# EAGLE design sample64pin (EAGLE 7.1.0)
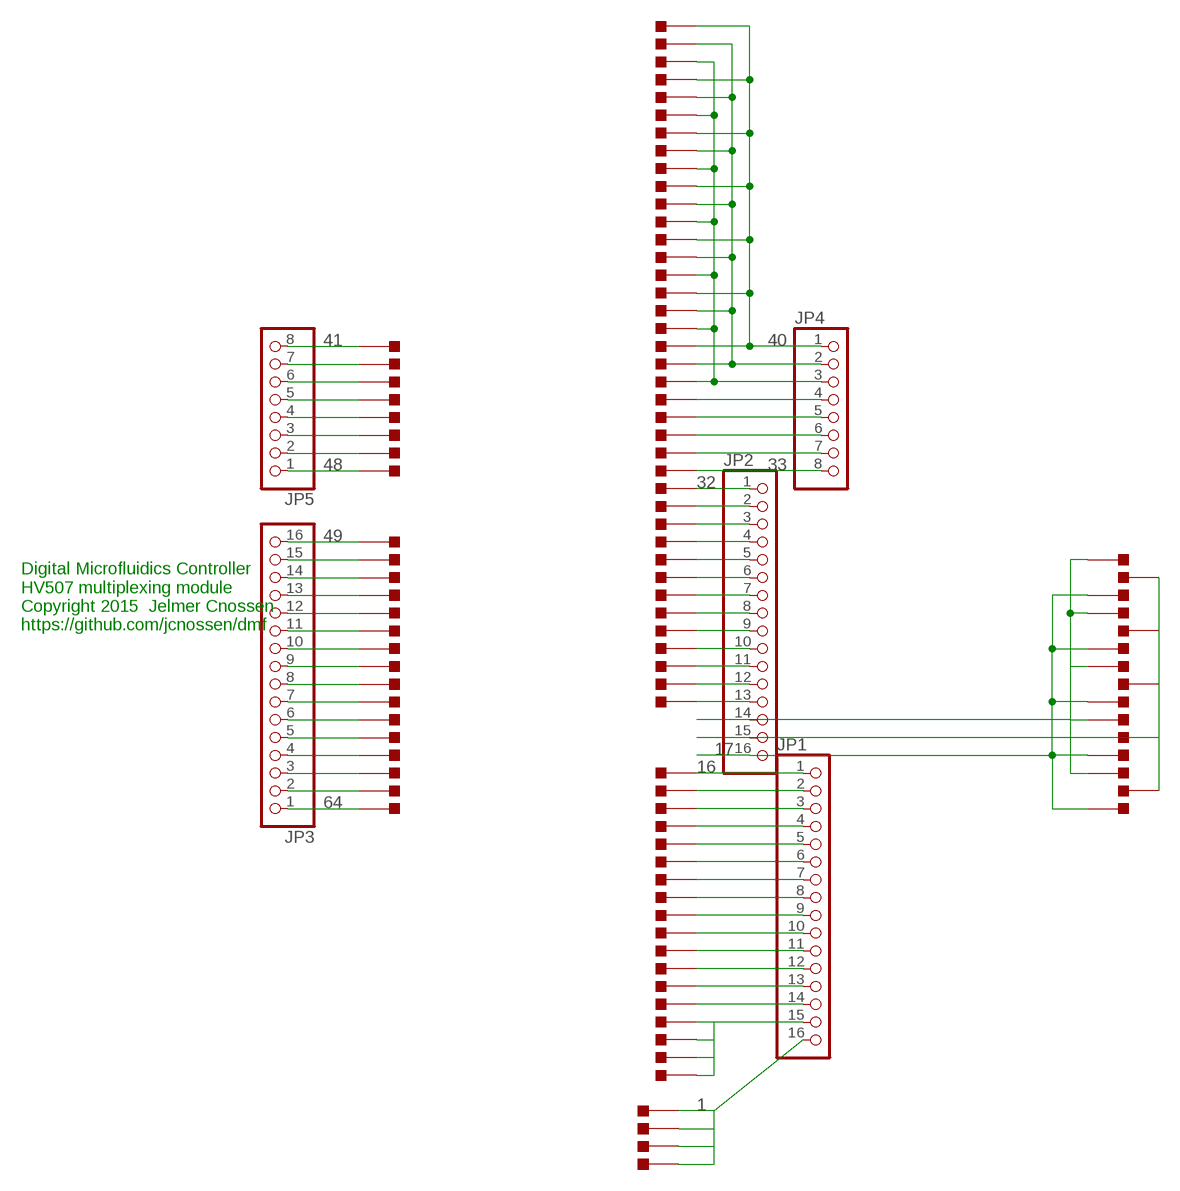
[diagram p0: schematic, sheet 1]

## Parts
JP1  PINHD-1X16_2.54-S  [1X16-S]
JP2  PINHD-1X16_2.54-S  [1X16-S]
JP3  PINHD-1X16_2.54-S  [1X16-S]
JP4  PINHD-1X08_2.54-S  [1X08-S]
JP5  PINHD-1X08_2.54-S  [1X08-S]
U$1  ELECTRODE  [ELECTRODE]
U$2  ELECTRODE  [ELECTRODE]
U$3  ELECTRODE  [ELECTRODE]
U$4  ELECTRODE  [ELECTRODE]
U$5  ELECTRODE  [ELECTRODE]
U$6  ELECTRODE  [ELECTRODE]
U$7  ELECTRODE  [ELECTRODE]
U$8  ELECTRODE  [ELECTRODE]
U$9  ELECTRODE  [ELECTRODE]
U$10  ELECTRODE  [ELECTRODE]
U$11  ELECTRODE  [ELECTRODE]
U$12  ELECTRODE  [ELECTRODE]
U$13  ELECTRODE  [ELECTRODE]
U$14  ELECTRODE  [ELECTRODE]
U$15  ELECTRODE  [ELECTRODE]
U$16  ELECTRODE  [ELECTRODE]
U$17  ELECTRODE  [ELECTRODE]
U$18  ELECTRODE  [ELECTRODE]
U$19  ELECTRODE  [ELECTRODE]
U$20  ELECTRODE  [ELECTRODE]
U$21  ELECTRODE  [ELECTRODE]
U$22  ELECTRODE  [ELECTRODE]
U$23  ELECTRODE  [ELECTRODE]
U$24  ELECTRODE  [ELECTRODE]
U$25  ELECTRODE  [ELECTRODE]
U$26  ELECTRODE  [ELECTRODE]
U$27  ELECTRODE  [ELECTRODE]
U$28  ELECTRODE  [ELECTRODE]
U$29  ELECTRODE  [ELECTRODE]
U$30  ELECTRODE  [ELECTRODE]
U$31  ELECTRODE  [ELECTRODE]
U$32  ELECTRODE  [ELECTRODE]
U$33  ELECTRODE  [ELECTRODE]
U$34  ELECTRODE  [ELECTRODE]
U$35  ELECTRODE  [ELECTRODE]
U$36  ELECTRODE  [ELECTRODE]
U$37  ELECTRODE  [ELECTRODE]
U$38  ELECTRODE  [ELECTRODE]
U$39  ELECTRODE  [ELECTRODE]
U$40  ELECTRODE  [ELECTRODE]
U$41  ELECTRODE  [ELECTRODE]
U$42  ELECTRODE  [ELECTRODE]
U$43  ELECTRODE  [ELECTRODE]
U$44  ELECTRODE  [ELECTRODE]
U$45  ELECTRODE  [ELECTRODE]
U$46  ELECTRODE  [ELECTRODE]
U$47  ELECTRODE  [ELECTRODE]
U$48  ELECTRODE  [ELECTRODE]
U$49  ELECTRODE  [ELECTRODE]
U$50  ELECTRODE  [ELECTRODE]
U$51  ELECTRODE  [ELECTRODE]
U$52  ELECTRODE  [ELECTRODE]
U$53  ELECTRODE  [ELECTRODE]
U$54  ELECTRODE  [ELECTRODE]
U$55  ELECTRODE  [ELECTRODE]
U$56  ELECTRODE  [ELECTRODE]
U$57  ELECTRODE  [ELECTRODE]
U$58  ELECTRODE  [ELECTRODE]
U$59  ELECTRODE  [ELECTRODE]
U$60  ELECTRODE  [ELECTRODE]
U$61  ELECTRODE  [ELECTRODE]
U$62  ELECTRODE  [ELECTRODE]
U$63  ELECTRODE  [ELECTRODE]
U$64  ELECTRODE  [ELECTRODE]
U$65  ELECTRODE  [ELECTRODE]
U$66  ELECTRODE  [ELECTRODE]
U$67  ELECTRODE  [ELECTRODE]
U$68  ELECTRODE  [ELECTRODE]
U$69  ELECTRODE  [ELECTRODE]
U$70  ELECTRODE  [ELECTRODE]
U$71  ELECTRODE  [ELECTRODE]
U$72  ELECTRODE  [ELECTRODE]
U$73  ELECTRODE  [ELECTRODE]
U$74  ELECTRODE  [ELECTRODE]
U$75  ELECTRODE  [ELECTRODE]
U$76  ELECTRODE  [ELECTRODE]
U$77  ELECTRODE  [ELECTRODE]
U$78  ELECTRODE  [ELECTRODE]
U$79  ELECTRODE  [ELECTRODE]
U$80  ELECTRODE  [ELECTRODE]
U$81  ELECTRODE  [ELECTRODE]
U$82  ELECTRODE  [ELECTRODE]
U$83  ELECTRODE  [ELECTRODE]
U$84  ELECTRODE  [ELECTRODE]
U$85  ELECTRODE  [ELECTRODE]
U$86  ELECTRODE  [ELECTRODE]
U$87  ELECTRODE  [ELECTRODE]
U$88  ELECTRODE  [ELECTRODE]
U$89  ELECTRODE  [ELECTRODE]
U$90  ELECTRODE  [ELECTRODE]
U$91  ELECTRODE  [ELECTRODE]
U$92  ELECTRODE  [ELECTRODE]
U$93  ELECTRODE  [ELECTRODE]
U$94  ELECTRODE  [ELECTRODE]
U$95  ELECTRODE  [ELECTRODE]
U$96  ELECTRODE  [ELECTRODE]
U$97  ELECTRODE  [ELECTRODE]
U$98  ELECTRODE  [ELECTRODE]
U$99  ELECTRODE  [ELECTRODE]
U$100  ELECTRODE  [ELECTRODE]

## Nets
1: JP1.16 U$46.P$2(E) U$47.P$2(E) U$48.P$2(E) U$64.P$2(E)
16: JP1.1 U$49.P$2(E)
17: JP2.16 U$67.P$2(E) U$70.P$2(E) U$73.P$2(E) U$76.P$2(E) U$79.P$2(E)
32: JP2.1 U$33.P$2(E)
33: JP4.8 U$32.P$2(E)
40: JP4.1 U$1.P$2(E) U$80.P$2(E) U$83.P$2(E) U$86.P$2(E) U$89.P$2(E) U$92.P$2(E) U$95.P$2(E)
41: JP5.8 U$4.P$2(E)
48: JP5.1 U$11.P$2(E)
49: JP3.16 U$12.P$2(E)
64: JP3.1 U$27.P$2(E)
N$1: JP2.14 U$65.P$2(E) U$68.P$2(E) U$71.P$2(E) U$74.P$2(E) U$77.P$2(E)
N$2: JP1.2 U$50.P$2(E)
N$3: JP1.3 U$51.P$2(E)
N$4: JP1.4 U$52.P$2(E)
N$5: JP1.5 U$53.P$2(E)
N$6: JP1.6 U$54.P$2(E)
N$7: JP1.7 U$55.P$2(E)
N$8: JP1.8 U$56.P$2(E)
N$9: JP1.9 U$57.P$2(E)
N$10: JP1.10 U$58.P$2(E)
N$11: JP1.11 U$59.P$2(E)
N$12: JP1.12 U$60.P$2(E)
N$13: JP1.13 U$61.P$2(E)
N$14: JP1.14 U$62.P$2(E)
N$15: JP1.15 U$63.P$2(E) U$98.P$2(E) U$99.P$2(E) U$100.P$2(E)
N$17: JP2.15 U$66.P$2(E) U$69.P$2(E) U$72.P$2(E) U$75.P$2(E) U$78.P$2(E)
N$18: JP2.2 U$34.P$2(E)
N$19: JP2.3 U$35.P$2(E)
N$20: JP2.4 U$36.P$2(E)
N$21: JP2.5 U$37.P$2(E)
N$22: JP2.6 U$38.P$2(E)
N$23: JP2.7 U$39.P$2(E)
N$24: JP2.8 U$40.P$2(E)
N$25: JP2.9 U$41.P$2(E)
N$26: JP2.10 U$42.P$2(E)
N$27: JP2.11 U$43.P$2(E)
N$28: JP2.12 U$44.P$2(E)
N$29: JP2.13 U$45.P$2(E)
N$34: JP3.2 U$26.P$2(E)
N$35: JP3.3 U$25.P$2(E)
N$36: JP3.4 U$24.P$2(E)
N$37: JP3.5 U$23.P$2(E)
N$38: JP3.6 U$22.P$2(E)
N$39: JP3.7 U$21.P$2(E)
N$40: JP3.8 U$20.P$2(E)
N$41: JP3.9 U$19.P$2(E)
N$42: JP3.10 U$18.P$2(E)
N$43: JP3.11 U$17.P$2(E)
N$44: JP3.12 U$16.P$2(E)
N$45: JP3.13 U$15.P$2(E)
N$46: JP3.14 U$14.P$2(E)
N$47: JP3.15 U$13.P$2(E)
N$50: JP4.2 U$2.P$2(E) U$81.P$2(E) U$84.P$2(E) U$87.P$2(E) U$90.P$2(E) U$93.P$2(E) U$96.P$2(E)
N$51: JP4.3 U$3.P$2(E) U$82.P$2(E) U$85.P$2(E) U$88.P$2(E) U$91.P$2(E) U$94.P$2(E) U$97.P$2(E)
N$52: JP4.4 U$28.P$2(E)
N$53: JP4.5 U$29.P$2(E)
N$54: JP4.6 U$30.P$2(E)
N$55: JP4.7 U$31.P$2(E)
N$58: JP5.2 U$10.P$2(E)
N$59: JP5.3 U$9.P$2(E)
N$60: JP5.4 U$8.P$2(E)
N$61: JP5.5 U$7.P$2(E)
N$62: JP5.6 U$6.P$2(E)
N$63: JP5.7 U$5.P$2(E)

## Notes on the sheet
- Digital Microfluidics Controller
  HV507 multiplexing module
  Copyright 2015  Jelmer Cnossen  
  https://github.com/jcnossen/dmf

## Library data of the parts
JP1-JP3 = pinhead-2:PINHD-1X16: PIN HEADER
JP4 JP5 = pinhead-2:PINHD-1X08: PIN HEADER
U$1-U$100 = hvgen:ELECTRODE

## Board
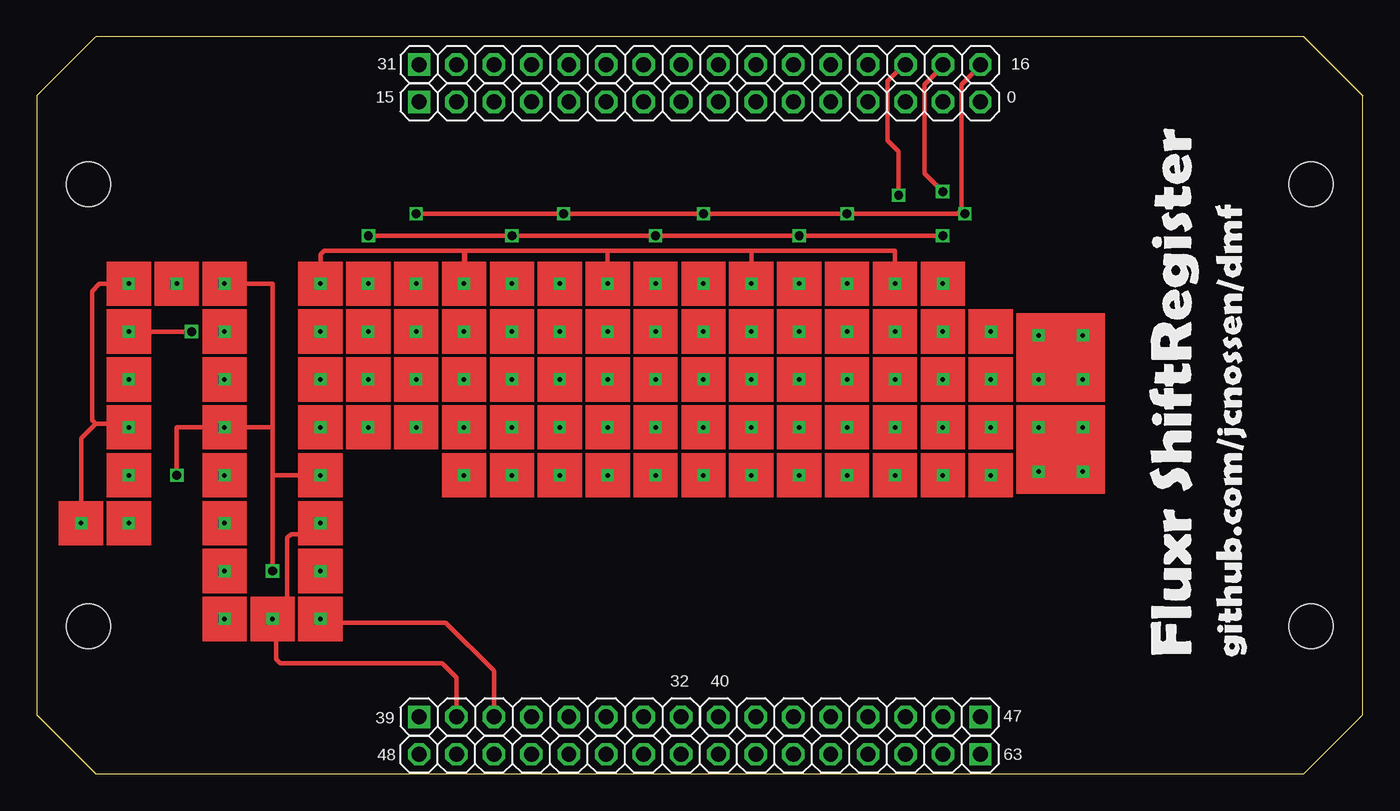
[diagram p1: board, top side]
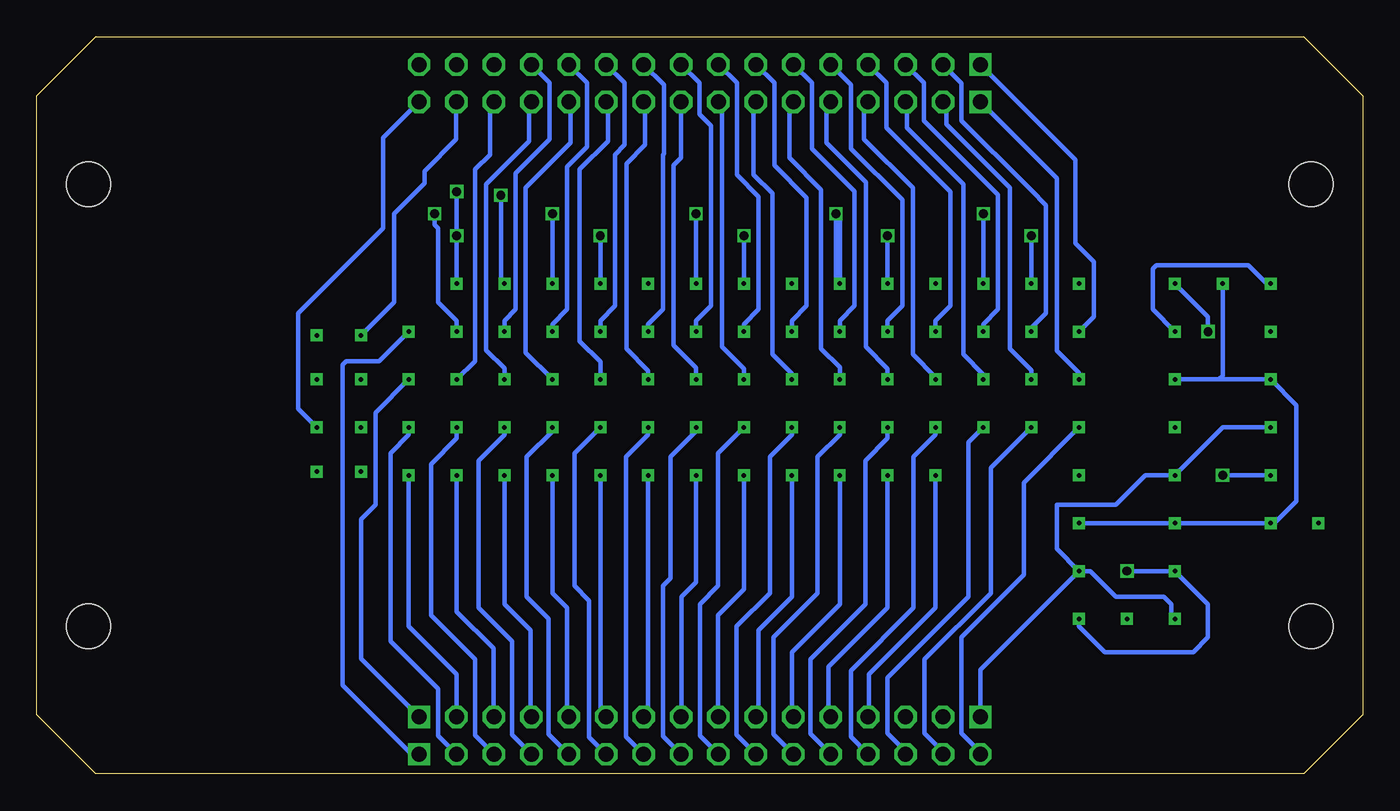
[diagram p2: board, bottom side, seen from below]

Size 90 x 50 mm. Coordinates in mm from the lower left corner, seen from the top.
Outline: 4,0 86,0 90,4 90,46 86,50 4,50 0,46 0,4 4,0
Copper layers (1*16): Top 0.035mm / dielectric 1.5mm / Bottom 0.035mm
Design rules "dirt_cheap_dirty_boards.v1": minimum track width 5mil, minimum drill 12mil, track to track 5mil, track to pad 5mil, pad to pad 5mil, via to via 5mil, smd to smd 0mil, copper to edge 10mil, drill to drill 10mil, minimum pad ring 10mil, minimum via ring 6mil, stop-mask expansion 2mil, vias tented up to drill 25mil, thermal gap 10mil
Holes 3 mm at 86.5,40 86.5,10 3.5,10 3.5,40

### Footprints (pad centres in the part's own frame; a part is rotated, then mirrored left to right if it is on the bottom)
1X16-S = drill 1.016 square: 1 -19.05,0 | drill 1.016 octagon: 2 -16.51,0; 3 -13.97,0; 4 -11.43,0; 5 -8.89,0; 6 -6.35,0; 7 -3.81,0; 8 -1.27,0; 9 1.27,0; 10 3.81,0; 11 6.35,0; 12 8.89,0; 13 11.43,0; 14 13.97,0; 15 16.51,0; 16 19.05,0
1X08-S = drill 1.016 square: 1 -8.89,0 | drill 1.016 octagon: 2 -6.35,0; 3 -3.81,0; 4 -1.27,0; 5 1.27,0; 6 3.81,0; 7 6.35,0; 8 8.89,0
ELECTRODE = drill 0.305 square: P$2 0,0

### Placement (x,y rotation side)
JP1  45,45.58 0 top
JP2  45,48.12 0 top
JP3  45,1.32 180 top
JP4  34.84,3.86 0 top
JP5  55.16,3.86 180 top
U$1  19.25,13.75 90 top
U$2  19.25,17 90 top
U$3  19.25,20.25 90 top
U$4  45.25,20.25 0 top
U$5  48.5,20.25 0 top
U$6  51.75,20.25 0 top
U$7  55,20.25 0 top
U$8  58.25,20.25 0 top
U$9  61.5,20.25 0 top
U$10  64.75,20.25 0 top
U$11  64.75,26.75 0 top
U$12  19.25,23.5 90 top
U$13  22.5,23.5 90 top
U$14  25.75,23.5 90 top
U$15  29,23.5 90 top
U$16  32.25,23.5 90 top
U$17  35.5,23.5 90 top
U$18  38.75,23.5 90 top
U$19  42,23.5 90 top
U$20  45.25,23.5 90 top
U$21  48.5,23.5 90 top
U$22  51.75,23.5 90 top
U$23  55,23.5 90 top
U$24  58.25,23.5 90 top
U$25  61.5,23.5 90 top
U$26  64.75,23.5 90 top
U$27  64.75,30 90 top
U$28  29,20.25 90 top
U$29  32.25,20.25 90 top
U$30  35.5,20.25 90 top
U$31  38.75,20.25 90 top
U$32  42,20.25 90 top
U$33  19.25,30 90 top
U$34  22.5,30 90 top
U$35  25.75,30 90 top
U$36  29,30 90 top
U$37  32.25,30 90 top
U$38  35.5,30 90 top
U$39  38.75,30 90 top
U$40  42,30 90 top
U$41  45.25,30 90 top
U$42  48.5,30 90 top
U$43  51.75,30 90 top
U$44  55,30 90 top
U$45  58.25,30 90 top
U$46  68,20.5 0 top
U$47  71,20.5 0 top
U$48  71,23.5 0 top
U$49  19.25,26.75 90 top
U$50  22.5,26.75 90 top
U$51  25.75,26.75 90 top
U$52  29,26.75 90 top
U$53  32.25,26.75 90 top
U$54  35.5,26.75 90 top
U$55  38.75,26.75 90 top
U$56  42,26.75 90 top
U$57  45.25,26.75 90 top
U$58  48.5,26.75 90 top
U$59  51.75,26.75 90 top
U$60  55,26.75 90 top
U$61  58.25,26.75 90 top
U$62  61.5,26.75 90 top
U$63  68,26.75 90 top
U$64  68,23.5 90 top
U$65  19.25,33.25 90 top
U$66  22.5,33.25 90 top
U$67  25.75,33.25 90 top
U$68  29,33.25 90 top
U$69  32.25,33.25 90 top
U$70  35.5,33.25 90 top
U$71  38.75,33.25 90 top
U$72  42,33.25 90 top
U$73  45.25,33.25 90 top
U$74  48.5,33.25 0 top
U$75  51.75,33.25 0 top
U$76  55,33.25 0 top
U$77  58.25,33.25 0 top
U$78  61.5,33.25 0 top
U$79  61.5,30 0 top
U$80  12.75,10.5 0 top
U$81  16,10.5 0 top
U$82  19.25,10.5 0 top
U$83  12.75,20.25 0 top
U$84  12.75,17 0 top
U$85  12.75,13.75 0 top
U$86  12.75,30 0 top
U$87  12.75,26.75 0 top
U$88  12.75,23.5 0 top
U$89  6.25,33.25 0 top
U$90  9.5,33.25 0 top
U$91  12.75,33.25 0 top
U$92  6.25,23.5 0 top
U$93  6.25,26.75 0 top
U$94  6.25,30 0 top
U$95  3,17 0 top
U$96  6.25,17 0 top
U$97  6.25,20.25 0 top
U$98  71,29.75 0 top
U$99  71,26.75 0 top
U$100  68,29.75 0 top

### Tracks (layer width: path | path; a pad name or v marks a point on that pad's centre or on a via)
1
  Top 0.305: U$64.P$2 U$48.P$2 U$47.P$2 U$46.P$2
  Bottom 0.305: JP1.16 66.48,43.15 66.48,37.02 72.25,31.25 72.25,24.75 U$48.P$2
16
  Bottom 0.305: 19.25,26.81 19.25,27.19 20.76,28.7 20.76,40.39 JP1.1
  Bottom 0.406: U$49.P$2 19.25,26.81
17  (via drill 0.6)
  Top 0.305: v25.75,38 v35.75,38 v45.25,38 v55,38 62.5,38 | JP2.16 64.05,48.05 62.75,46.75 62.75,38.25 62.5,38 | 62.5,38 v63,38
  Bottom 0.305: U$67.P$2 v25.75,38 | U$73.P$2 v45.25,38 | U$76.P$2 v55,38 | U$79.P$2 61.5,30.75 62.75,32 62.75,37 63,37.25 v63,38 | v35.75,38 35.75,33.5 U$70.P$2 35.5,37.75 v35.75,38
32
  Bottom 0.305: JP2.1 19.5,41.67 19.5,36 18.25,34.75 18.25,31 U$33.P$2
33
  Bottom 0.305: U$32.P$2 42,12.5 43.75,10.75 43.75,3.88 JP4.8
40
  Top 0.305: U$89.P$2 4.25,33.25 3.75,32.75 3.75,24 4,23.75 | 4,23.75 6,23.75 U$92.P$2 | U$95.P$2 3,22.75 4,23.75
  Bottom 0.305: U$92.P$2 9.5,23.5 U$83.P$2 14.75,20.25 16.75,18.25 20.75,18.25 20.75,15.25 U$1.P$2 | U$89.P$2 6.5,33.25 7.75,34.5 14,34.5 14.25,34.25 14.25,31.5 U$86.P$2 | U$1.P$2 18.5,13.75 16.75,12 13.5,12 13,11.5 13,10.75 U$80.P$2 | JP4.1 25.95,7.05 U$1.P$2
41
  Bottom 0.305: U$4.P$2 45.25,13 46.25,12 46.25,3.88 JP5.8
48
  Bottom 0.305: JP5.1 68,7.81 68,17.25 67,18.25 67,24.5 U$11.P$2
49
  Bottom 0.305: JP3.16 25.95,1.45 27.25,2.75 27.25,9.25 23,13.5 23,19.75 U$12.P$2
64
  Bottom 0.305: JP3.1 64.57,1.32 69.25,6 69.25,27.75 69,28 66.75,28 U$27.P$2
N$1  (via drill 0.6)
  Top 0.305: U$65.P$2 19.25,35.25 19.5,35.5 29,35.5 | 29,35.5 U$68.P$2 29.06,33.31 29.06,35.44 29,35.5 | 29,35.5 38.75,35.5 | U$71.P$2 38.75,35.5 | 38.75,35.5 48.5,35.5 | U$74.P$2 48.5,35.5 | 48.5,35.5 58.25,35.5 U$77.P$2 | JP2.14 58.87,48.12 57.75,47 57.75,43 58.5,42.25 v58.5,39.25
  Bottom 0.305: v58.5,39.25 58.5,33.5 U$77.P$2
N$2
  Bottom 0.305: U$50.P$2 22.5,27.39 23.94,28.83 23.94,39.75 28.26,44.07 28.26,45.34 JP1.2
N$3
  Bottom 0.305: U$51.P$2 25.75,27.09 27.11,28.45 27.11,40.01 30.92,43.81 30.92,45.47 JP1.3
N$4
  Bottom 0.305: U$52.P$2 29,26.91 30.54,28.45 30.54,39.75 33.84,43.05 33.84,45.31 JP1.4
N$5
  Bottom 0.305: U$53.P$2 32.25,27.49 33.72,28.96 33.72,40.13 36.38,42.8 36.38,45.31 JP1.5
N$6
  Bottom 0.305: U$54.P$2 35.5,27.57 36.76,28.83 36.76,39.62 38.92,41.78 38.92,45.31 JP1.6
N$7
  Bottom 0.305: U$55.P$2 38.75,27.13 40.07,28.45 40.07,39.37 41.34,40.64 41.34,45.43 JP1.7
N$8
  Bottom 0.305: U$56.P$2 42,27.46 43.5,28.96 43.5,45.34 JP1.8
N$9
  Bottom 0.305: U$57.P$2 45.25,27.54 46.8,29.08 46.8,41.27 46.29,41.78 46.29,45.97 46.16,46.1 46.16,45.69 JP1.9
N$10
  Bottom 0.305: U$58.P$2 48.5,27.36 49.97,28.83 49.97,41.4 48.7,42.67 48.7,45.47 JP1.10
N$11
  Bottom 0.305: U$59.P$2 51.75,27.94 53.15,29.34 53.15,41.02 51.24,42.93 51.24,45.47 JP1.11
N$12
  Bottom 0.305: U$60.P$2 56.83,28.57 56.83,39.75 53.78,42.8 53.78,45.47 JP1.12
N$13
  Bottom 0.305: U$61.P$2 58.25,27.5 59.5,28.75 59.5,40 56.58,42.93 56.58,45.43 JP1.13
N$14
  Bottom 0.305: JP1.14 59.24,45.31 59.24,42.01 60.25,41 60.25,28 U$62.P$2
N$15
  Top 0.305: U$63.P$2 U$100.P$2 U$98.P$2 U$99.P$2
  Bottom 0.305: JP1.15 61.53,45.56 61.53,43.05 63.69,40.89 63.69,40.06 65.75,38 65.75,32 U$100.P$2
N$17  (via drill 0.6)
  Top 0.305: v22.5,36.5 v32.25,36.5 v42,36.5 v51.75,36.5 v61.5,36.5 | JP2.15 61.51,48.01 60.25,46.75 60.25,40.75 v61.5,39.5
  Bottom 0.305: U$66.P$2 v22.5,36.5 | U$69.P$2 v32.25,36.5 | U$72.P$2 v42,36.5 | U$75.P$2 v51.75,36.5 | U$78.P$2 v61.5,36.5 v61.5,39.5
N$18
  Bottom 0.305: JP2.2 27.24,46.86 27.24,44.32 22.83,39.92 22.5,39.58 21.5,38.58 21.5,31.25 22.5,30.25 U$34.P$2
N$19
  Bottom 0.305: JP2.3 29.78,46.87 29.78,44.32 24.75,39.29 24.75,31.5 25.75,30.5 U$35.P$2
N$20
  Bottom 0.305: JP2.4 32.32,46.87 32.32,43.81 28,39.5 28,31.75 29,30.75 U$36.P$2
N$21
  Bottom 0.305: JP2.5 34.73,46.74 34.73,42.42 31.25,38.94 31.25,31.75 32.25,30.75 U$37.P$2
N$22
  Bottom 0.305: JP2.6 37.4,46.87 37.4,42.42 34.5,39.52 34.5,31.75 35.5,30.75 U$38.P$2
N$23
  Bottom 0.305: JP2.7 39.94,46.87 39.94,41.27 37.75,39.09 37.75,31.75 38.75,30.75 U$39.P$2
N$24
  Bottom 0.305: JP2.8 42.48,46.87 42.48,40.64 41,39.16 41,31.5 42,30.5 U$40.P$2
N$25
  Bottom 0.305: JP2.9 45.02,46.87 45.02,44.75 44.25,43.98 44.25,31.75 45.25,30.75 U$41.P$2
N$26
  Bottom 0.305: JP2.10 47.43,46.74 47.43,42.07 47.5,42 47.5,31.5 48.5,30.5 U$42.P$2
N$27
  Bottom 0.305: JP2.11 50.1,46.87 50.1,42.67 50.76,42.01 50.75,42 50.75,31.75 51.75,30.75 U$43.P$2
N$28
  Bottom 0.305: JP2.12 52.64,46.87 52.64,42.55 54,41.18 54,31.5 55,30.5 U$44.P$2
N$29
  Bottom 0.305: JP2.13 55.18,46.87 55.18,43.05 57.5,40.73 57.5,31.5 58.25,30.75 U$45.P$2
N$34
  Bottom 0.305: U$26.P$2 64.75,23 66,21.75 66,9 62.75,5.75 62.75,2.56 JP3.2
N$35
  Bottom 0.305: U$25.P$2 61.5,22.75 63.25,21 63.25,10.75 60.25,7.75 60.25,2.6 JP3.3
N$36
  Bottom 0.305: U$24.P$2 58.25,23 60,21.25 60,11.25 57.75,9 57.75,2.64 JP3.4
N$37
  Bottom 0.305: U$23.P$2 55,23.25 56.75,21.5 56.75,12 55.25,10.5 55.25,2.68 JP3.5
N$38
  Bottom 0.305: U$22.P$2 53.5,21.75 53.5,12.75 52.5,11.75 52.5,2.47 JP3.6
N$39
  Bottom 0.305: U$21.P$2 48.5,23 50,21.5 50,2.51 JP3.7
N$40
  Bottom 0.305: U$20.P$2 45.25,23.25 47,21.5 47,13.25 47.5,12.75 47.5,2.55 JP3.8
N$41
  Bottom 0.305: U$19.P$2 43.75,21.75 43.75,12.75 45,11.5 45,2.59 JP3.9
N$42
  Bottom 0.305: U$18.P$2 38.75,23 40.25,21.5 40.25,12.25 42.5,10 42.5,2.63 JP3.10
N$43
  Bottom 0.305: U$17.P$2 35.5,23 37,21.5 37,12.25 40,9.25 40,2.67 JP3.11
N$44
  Bottom 0.305: U$16.P$2 32.25,22.75 33.75,21.25 33.75,11.5 37.5,7.75 37.5,2.71 JP3.12
N$45
  Bottom 0.305: U$15.P$2 29,23 30.5,21.5 30.5,11.25 34.75,7 34.75,2.5 JP3.13
N$46
  Bottom 0.305: JP3.14 31.03,1.53 32.25,2.75 32.25,6.5 26.75,12 26.75,22.5 U$14.P$2
N$47
  Bottom 0.305: JP3.15 28.49,1.49 29.75,2.75 29.75,7.75 25.25,12.25 25.25,20.75 U$13.P$2
N$50
  Top 0.305: U$2.P$2 18.5,16.25 17.25,16.25 17,16 17,11.75 16,10.75 U$81.P$2 16.25,10.25 16.25,7.75 16.5,7.5 27.5,7.5 28.49,6.51 JP4.2
  Bottom 0.305: U$87.P$2 9.75,26.75 | 9.75,26.75 U$93.P$2 4.5,25 4.5,18.5 6,17 U$96.P$2 U$84.P$2 U$2.P$2 | U$90.P$2 9.5,27 9.75,26.75
N$51  (via drill 0.6)
  Top 0.305: v16,13.75 16,20.25 | 16,20.25 16,23.5 | 16,23.5 16,33.25 U$91.P$2 | v9.5,20.25 9.5,23.5 U$88.P$2 16,23.5 | U$94.P$2 v10.5,30 | U$3.P$2 16,20.25 | JP4.3 31.03,6.97 27.75,10.25 19.5,10.25 U$82.P$2
  Bottom 0.305: v16,13.75 U$85.P$2 10.5,11.5 10.5,9.25 11.5,8.25 17.5,8.25 19.25,10 U$82.P$2 | U$97.P$2 v9.5,20.25 | v10.5,30 10.5,31 U$91.P$2
N$52
  Bottom 0.305: U$28.P$2 29,11.25 33.5,6.75 33.5,3.93 JP4.4
N$53
  Bottom 0.305: U$29.P$2 32.25,11.25 36.25,7.25 36.25,4 JP4.5
N$54
  Bottom 0.305: U$30.P$2 35.5,11.5 38.75,8.25 38.75,3.96 JP4.6
N$55
  Bottom 0.305: U$31.P$2 38.75,12 41,9.75 41,4.05 JP4.7
N$58
  Bottom 0.305: U$10.P$2 64.75,10 61.5,6.75 JP5.2
N$59
  Bottom 0.305: U$9.P$2 61.5,11 59,8.5 59,3.89 JP5.3
N$60
  Bottom 0.305: U$8.P$2 58.25,11.5 56.5,9.75 56.5,3.93 JP5.4
N$61
  Bottom 0.305: U$7.P$2 55,12.25 54,11.25 54,3.97 JP5.5
N$62
  Bottom 0.305: U$6.P$2 51.75,4.26 JP5.6
N$63
  Bottom 0.305: U$5.P$2 48.5,4.17 JP5.7

### Text on the board
tPlace: 31 | 16 | 15 | 0 | 32 | 40 | 47 | 39 | 48 | 63